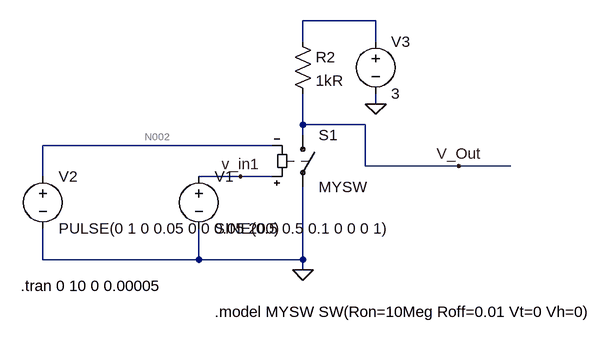
[diagram p0: schematic Draft1.asc]
Draft1.asc, the LTspice schematic file:
Version 4
SHEET 1 880 680
WIRE 288 -80 176 -80
WIRE 176 -48 176 -80
WIRE 288 -48 288 -80
WIRE 288 48 288 32
WIRE 176 80 176 32
WIRE 272 80 176 80
WIRE 176 96 176 80
WIRE 128 112 -224 112
WIRE 272 144 272 80
WIRE 416 144 272 144
WIRE 496 144 416 144
WIRE -224 160 -224 112
WIRE 80 160 16 160
WIRE 128 160 80 160
WIRE -224 288 -224 240
WIRE 16 288 16 240
WIRE 16 288 -224 288
WIRE 176 288 176 176
WIRE 176 288 16 288
WIRE 176 304 176 288
FLAG 176 304 0
FLAG 288 48 0
FLAG 416 144 V_Out
FLAG 80 160 v_in1
SYMBOL voltage 16 144 R0
WINDOW 123 0 0 Left 0
WINDOW 39 0 0 Left 0
SYMATTR InstName V1
SYMATTR Value SINE(0.5 0.5 0.1 0 0 0 1)
SYMBOL voltage -224 144 R0
WINDOW 123 0 0 Left 0
WINDOW 39 0 0 Left 0
SYMATTR InstName V2
SYMATTR Value PULSE(0 1 0 0.05 0 0 0.05 200)
SYMBOL voltage 288 -64 R0
WINDOW 123 0 0 Left 0
WINDOW 39 0 0 Left 0
SYMATTR InstName V3
SYMATTR Value 3
SYMBOL sw 176 80 R0
SYMATTR InstName S1
SYMATTR Value MYSW
SYMBOL res 160 -64 R0
SYMATTR InstName R2
SYMATTR Value 1kR
TEXT -258 328 Left 2 !.tran 0 10 0 0.00005
TEXT 40 368 Left 2 !.model MYSW SW(Ron=10Meg Roff=0.01 Vt=0 Vh=0)

The netlist it stands for:
* Draft1.asc
V1 v_in1 0 SINE(0.5 0.5 0.1 0 0 0 1)
V2 N002 0 PULSE(0 1 0 0.05 0 0 0.05 200)
V3 N001 0 3
S1 V_Out 0 v_in1 N002 MYSW
R2 N001 V_Out 1kR
.tran 0 10 0 0.00005
.model MYSW SW(Ron=10Meg Roff=0.01 Vt=0 Vh=0)
.backanno
.end

* Results of the author's LTspice run, read from the files saved beside the schematic
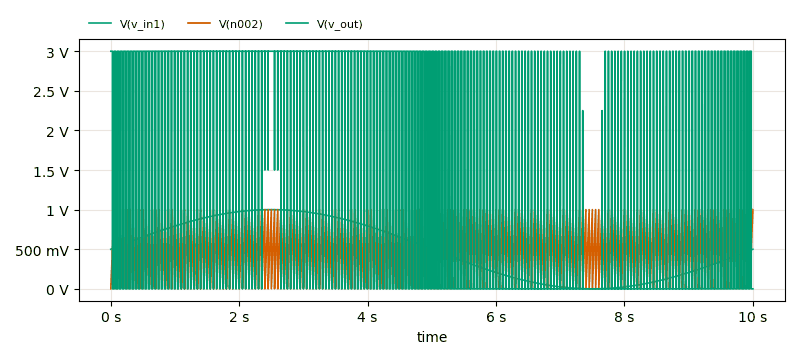
[diagram p1: Transient Analysis of Draft1.asc, plotted from the saved traces]
* Transient Analysis, 1 run:
*   V(v_in1): min 0 V, max 1 V, average 500 mV, rms 612.4 mV, last 500 mV
*   V(n002): min 0 V, max 1 V, average 500.4 mV, rms 626.5 mV, last 1 V
*   V(v_out): min 30 µV, max 3 V, average 1.499 V, rms 2.119 V, last 30 µV